# Altium project Lab7_Buhakova.PrjPcb
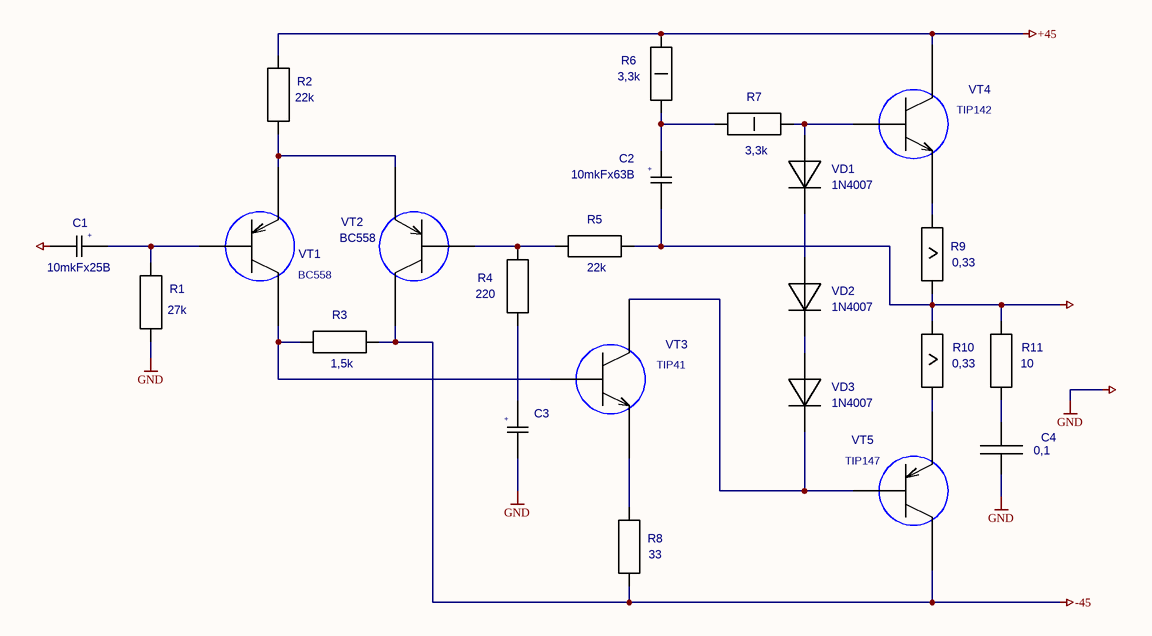
[diagram p0: Lab7SCH.SchDoc]
1 sheet, 23 parts. Net scope: global (net labels, ports and power ports of the same name join across sheets).
Board file: Lab7PCB.PcbDoc

## Sheet Lab7SCH.SchDoc
size A4; SheetNumber: 1; SheetTotal: 1

### Parts
C1  10mkFx25B  [K50_29]
C2  10mkFx63B  [K50_29]
C3  K50_29  [K50_29]  (value not drawn)
C4  0,1  [�10-17�-4]
R1  27k  [C2-33H-0.125W]
R2  22k  [C2-33H-0.125W]
R3  1,5k  [C2-33H-0.125W]
R4  220  [C2-33H-0.125W]
R5  22k  [C2-33H-0.125W]
R6  3,3k  [C2-33H-1W_17.5MM]
R7  3,3k  [C2-33H-1W_17.5MM]
R8  33  [C2-33H-0.125W]
R9  0,33  [C2-33H-0.5W_15MM]
R10  0,33  [C2-33H-0.5W_15MM]
R11  10  [C2-33H-0.125W]
VD1  1N4007  [DO-41(DO-204AL)_1N4007(Primary)]
VD2  1N4007  [DO-41(DO-204AL)_1N4007(Primary)]
VD3  1N4007  [DO-41(DO-204AL)_1N4007(Primary)]
VT1  BC558  [��320�]
VT2  BC558  [2T602A]
VT3  TIP41  [��101]
VT4  TIP142  [��101]
VT5  TIP147  [��320�]

### Nets
+45: R2.1(I/O0) R6.2 VT4.3(K)
-45: R3.2(I/O1) R8.2(I/O1) VT2.1 VT5.2(K)
GND: C1.1 C2.1 C3.1 C4.2 R1.2(I/O1) R5.2(I/O1) R9.2 R10.1 R11.1(I/O0)
NetC1_2: C1.2 R1.1(I/O0) VT1.3(B)
NetC2_2: C2.2 R6.1 R7.1
NetC3_2: C3.2 R4.1(I/O0)
NetC4_1: C4.1 R11.2(I/O1)
NetR2_2: R2.2(I/O1) VT1.1(E) VT2.3
NetR3_1: R3.1(I/O0) VT1.2(K) VT3.2(B)
NetR4_2: R4.2(I/O1) R5.1(I/O0) VT2.2
NetR7_2: R7.2 VD1.A VT4.2(B)
NetR8_1: R8.1(I/O0) VT3.1(E)
NetR9_1: R9.1 VT4.1(E)
NetR10_2: R10.2 VT5.1(E)
NetVD1_K: VD1.K VD2.A
NetVD2_K: VD2.K VD3.A
NetVD3_K: VD3.K VT3.3(K) VT5.3(B)

### Notes on the sheet
- (in symbol K50_29) +

### Library data of the parts
C1 C2 = K50_29: Value: *
C4 = �10-17�-�1500-18��: Value: *
R1-R5 R8 R11 = �2-23-0,125 ��: Value: *
R6 R7 = C2-33H-1W_OLD_UGO: Autor: pcbdesigner.ru; Value: *
R9 R10 = C2-33H-0.5W_OLD_UGO: Autor: pcbdesigner.ru; Value: *
VT1 VT5 = 1�320�_1: Value: *
VT2 = TRANSISTOR_(1111): Value: *
VT3 VT4 = ��101: Value: *
C3 = K50_29: Value: *
VD1-VD3 = 1N4007: Value: *